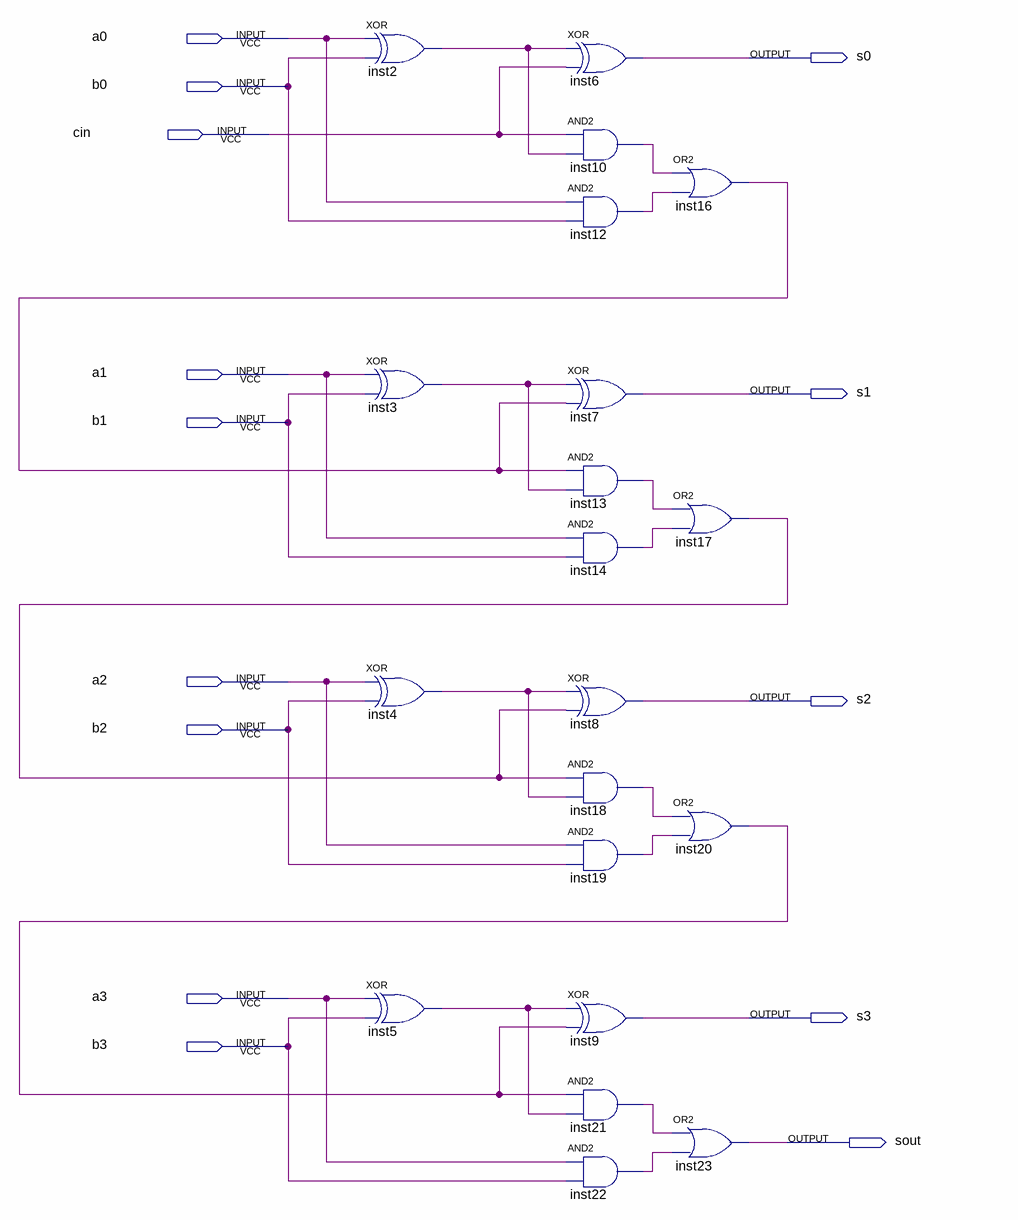
[diagram p0: schematic sheet]
// Quartus schematic part2schematic.bdf as structural Verilog: 20 symbols, 14 pins
module part2schematic (
  input  a0,
  input  b0,
  input  cin,
  input  a1,
  input  b1,
  input  a2,
  input  b2,
  input  a3,
  input  b3,
  output s0,
  output s1,
  output s2,
  output s3,
  output sout
);

  wire inst2_out, inst3_out, inst4_out, inst5_out, inst10_out, inst12_out, inst13_out, inst14_out,
       inst16_out, inst17_out, inst18_out, inst19_out, inst20_out, inst21_out, inst22_out;

  xor inst2 (inst2_out, a0, b0);
  xor inst3 (inst3_out, a1, b1);
  xor inst4 (inst4_out, a2, b2);
  xor inst5 (inst5_out, a3, b3);
  xor inst6 (s0, inst2_out, cin);
  and inst10 (inst10_out, cin, inst2_out);
  and inst12 (inst12_out, a0, b0);
  xor inst7 (s1, inst3_out, inst16_out);
  and inst13 (inst13_out, inst16_out, inst3_out);
  and inst14 (inst14_out, a1, b1);
  xor inst8 (s2, inst4_out, inst17_out);
  and inst18 (inst18_out, inst17_out, inst4_out);
  and inst19 (inst19_out, a2, b2);
  xor inst9 (s3, inst5_out, inst20_out);
  and inst21 (inst21_out, inst20_out, inst5_out);
  and inst22 (inst22_out, a3, b3);
  or inst16 (inst16_out, inst10_out, inst12_out);
  or inst17 (inst17_out, inst13_out, inst14_out);
  or inst20 (inst20_out, inst18_out, inst19_out);
  or inst23 (sout, inst21_out, inst22_out);
endmodule
